# EAGLE design JDM2_NoSocket_Mirrored (EAGLE 7.6.0)
JDM2 without DIL-Socket
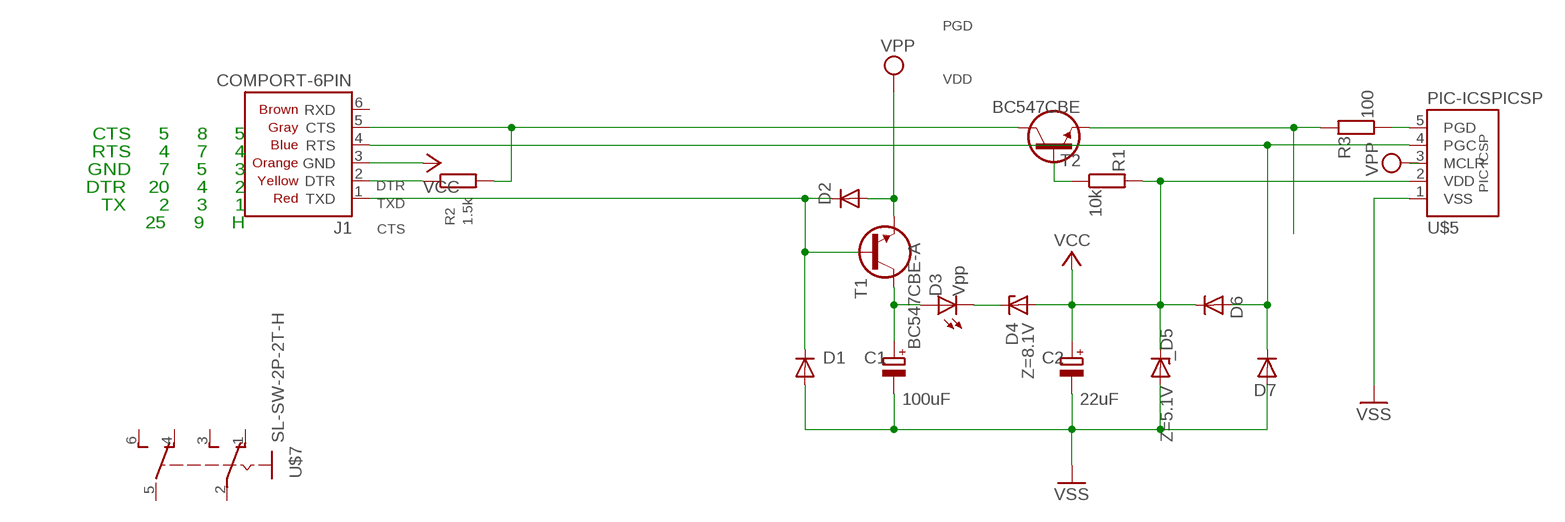
[diagram p0: schematic, sheet 1]

## Parts
_D5  Z=5.1V  Z-DIODEZ2_54  [DO35Z2_54]
C1  100uF  CPOLE5-4  [E5-4]
C2  22uF  CPOLE2,5-4  [E2,5-4]
D1  1N4148  1N414834-2,5-A  [DO34-2,5-A]
D2  1N4148  1N414834-7  [DO34-7]
D3  Vpp  LED3MM  [LED3MM]
D4  Z=8.1V  Z-DIODE34Z5  [DO34Z5]
D6  1N4148  1N414834-5  [DO34-5]
D7  1N4148  1N414834-7  [DO34-7]
J1  COMPORT-6PIN  [RS232-6PIN]
R1  10k  R0202/5  [0202/5]
R2  1.5k  R0202/7  [0202/7]
R3  100  R0202/5  [0202/5]
T1  BC547CBE-A  [TO92-CBE-A]
T2  BC547CBE  [TO92-CBE]
U$5  PIC-ICSPICSP  [PIC-ICSP]
U$7  SL-SW-2P-2T-H  [SLSW-2P2T-H]

## Nets
/MCLR: D2.A T1.E U$5.3(MCLR) ; supply symbol labelled VPP
CLK: D6.A D7.C J1.4(RTS) U$5.4(PGC)
CTS: J1.5(CTS) R2.2 T2.C
DATA: R3.2 T2.E
DTR: J1.2(DTR) R2.1
N$1: R1.1 T2.B
N$5: D3.K(C) D4.C
PGD: R3.1 U$5.5(PGD)
TXD: D1.C D2.C J1.1(TXD) T1.B
VDD: _D5.C C2.+ D4.A D6.C J1.3(GND) R1.2 U$5.2(VDD) ; supply symbol labelled VCC
VPP: C1.+ D3.A T1.C
VSS: _D5.A C1.- C2.- D1.A D7.A U$5.1(VSS)
Unconnected: J1.6(RXD) U$7.1(O) U$7.2(P) U$7.3(S) U$7.4(O1) U$7.5(P1) U$7.6(S1)

## Notes on the sheet
- CTS     5     8     5
- RTS     4     7     4
- GND     7     5     3
- DTR    20     4     2
- TX      2     3     1
- 25     9     H

## Library data of the parts
_D5 D4 = d:Z-DIODE
C1 C2 = c:CPOL: POLARIZED CAPACITOR, European symbol
D1 D2 D6 D7 = d:1N4148
D3 = led:LED: LED OSRAM: - CHIPLED LG R971, LG N971, LY N971, LG Q971, LY Q971, LO R971, LY R971 LH N974, LH R974 LS Q976, LO Q976, LY Q976 LO Q996 - Hyper CHIPLED LW Q18S LB Q993, LB Q99A, LB R99A - SideLED LS A670, LO A670, LY A670, LG A670, LP A670 LB A673, LV A673, LT A673, LW A673 LH A674 LY A675 LS A676, LA A676, LO A676, LY A676, LW A676 LS A679, LY A679, LG A679 - Hyper Micro SIDELED® LS Y876, LA Y876, LO Y876, LY Y876 LT Y87S - SmartLED LW L88C, LW L88S LB L89C, LB L89S, LG L890 LS L89K, LO L89K, LY L89K LS L896, LA L896, LO L896, LY L896 - TOPLED LS T670, LO T670, LY T670, LG T670, LP T670 LSG T670, LSP T670, LSY T670, LOP T670, LYG T670 LG T671, LOG T671, LSG T671 LB T673, LV T673, LT T673, LW T673 LH T674 LS T676, LA T676, LO T676, LY T676, LB T676, LH T676, LSB T676, LW T676 LB T67C, LV T67C, LT T67C, LS T67K, LO T67K, LY T67K, LW E67C LS E67B, LA E67B, LO E67B, LY E67B, LB E67C, LV E67C, LT E67C LW T67C LS T679, LY T679, LG T679 LS T770, LO T770, LY T770, LG T770, LP T770 LB T773, LV T773, LT T773, LW T773 LH T774 LS E675, LA E675, LY E675, LS T675 LS T776, LA T776, LO T776, LY T776, LB T776 LHGB T686 LT T68C, LB T68C - Hyper Mini TOPLED® LB M676 - Mini TOPLED Santana® LG M470 LS M47K, LO M47K, LY M47K Source: http://www.osram.convergy.de LUXEON: - LUMILED® LXK2-PW12-R00, LXK2-PW12-S00, LXK2-PW14-U00, LXK2-PW14-V00 LXK2-PM12-R00, LXK2-PM12-S00, LXK2-PM14-U00 LXK2-PE12-Q00, LXK2-PE12-R00, LXK2-PE12-S00, LXK2-PE14-T00, LXK2-PE14-U00 LXK2-PB12-K00, LXK2-PB12-L00, LXK2-PB12-M00, LXK2-PB14-N00, LXK2-PB14-P00, LXK2-PB14-Q00 LXK2-PR12-L00, LXK2-PR12-M00, LXK2-PR14-Q00, LXK2-PR14-R00 LXK2-PD12-Q00, LXK2-PD12-R00, LXK2-PD12-S00 LXK2-PH12-R00, LXK2-PH12-S00 LXK2-PL12-P00, LXK2-PL12-Q00, LXK2-PL12-R00 Source: www.luxeon.com KINGBRIGHT: KA-3528ASYC Source: www.kingbright.com
J1 = pinconn:COMPORT-6PIN
R1-R3 = r:R: RESISTOR, European symbol
T1 T2 = t:BC547
U$5 = pinconn:PIC-ICSP
U$7 = sw:SL-SW-2P-2T

## Net classes
0 default: width 0.559 mm
1 power: width 0.559 mm

## Board
JDM2 without DIL-Socket
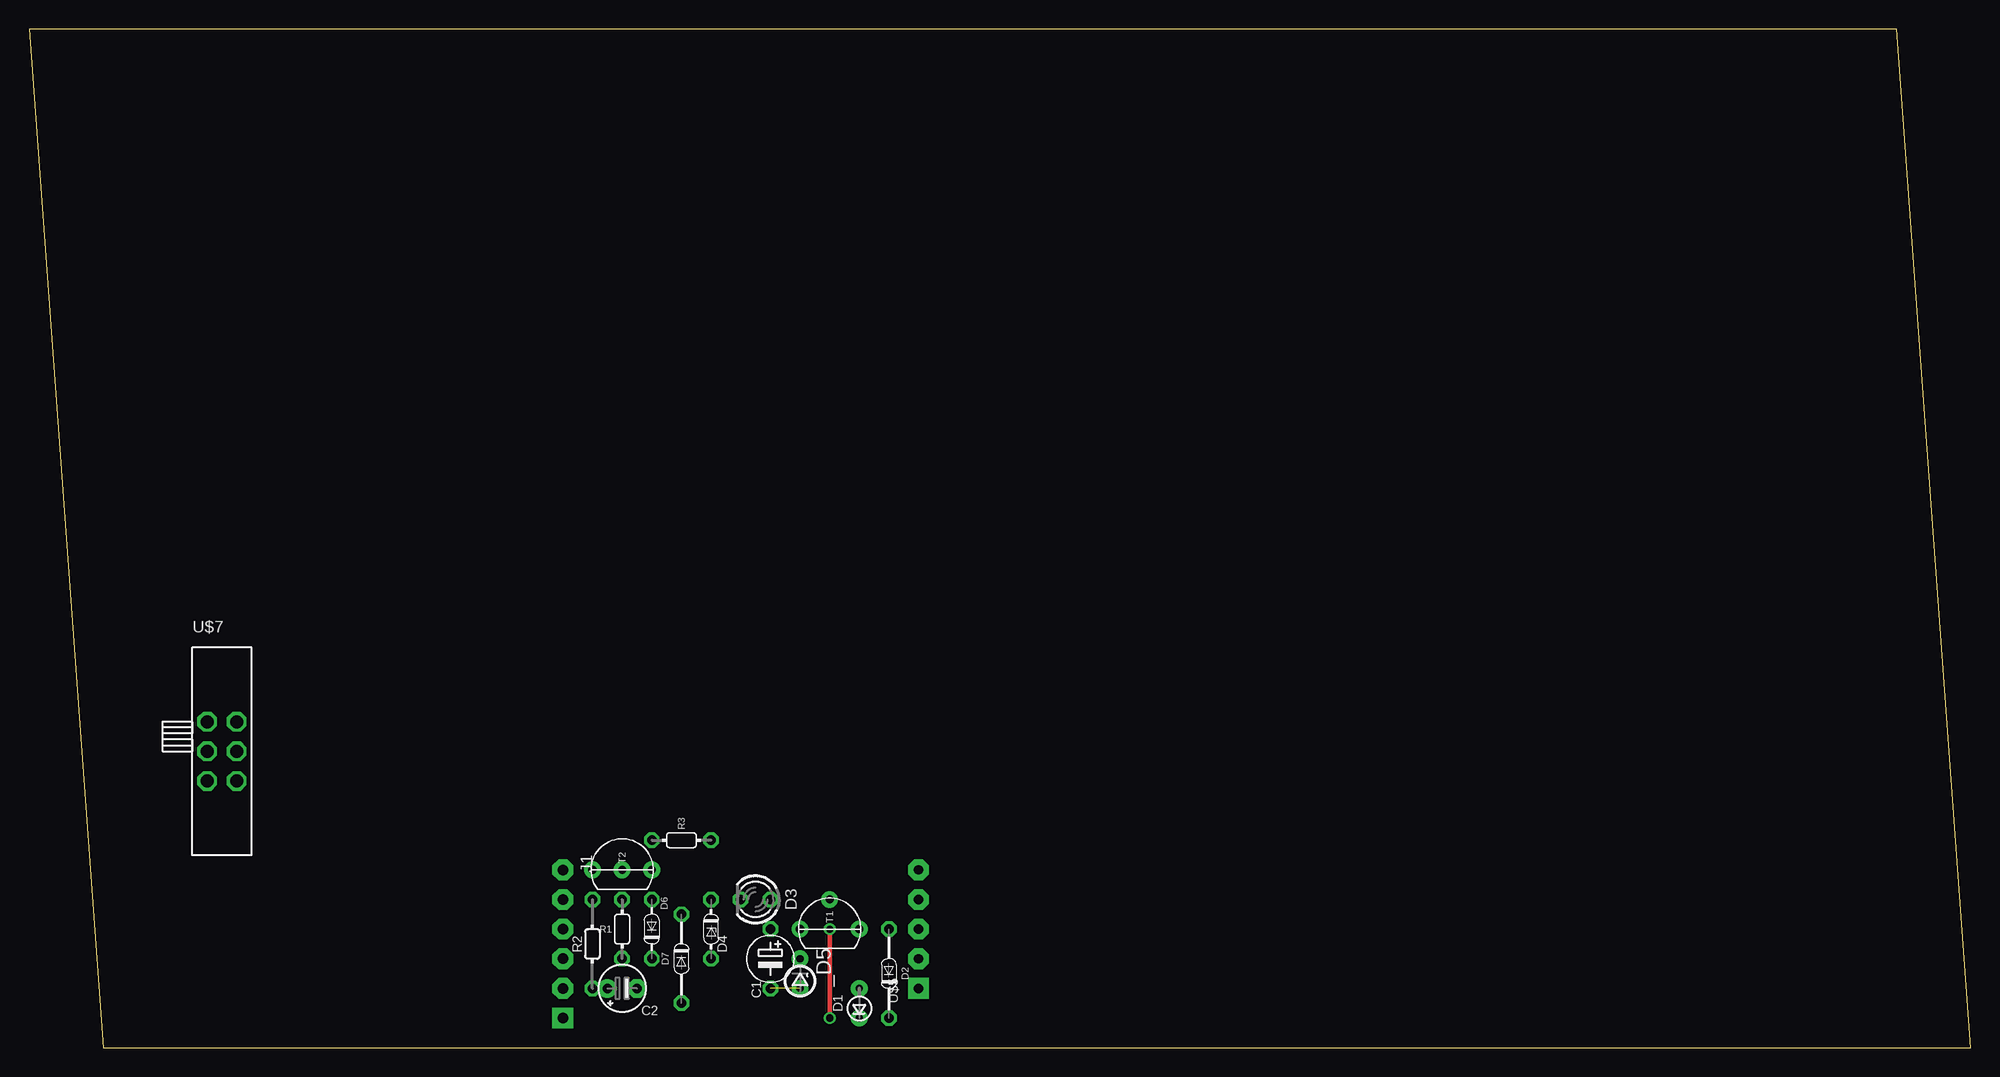
[diagram p1: board, top side]
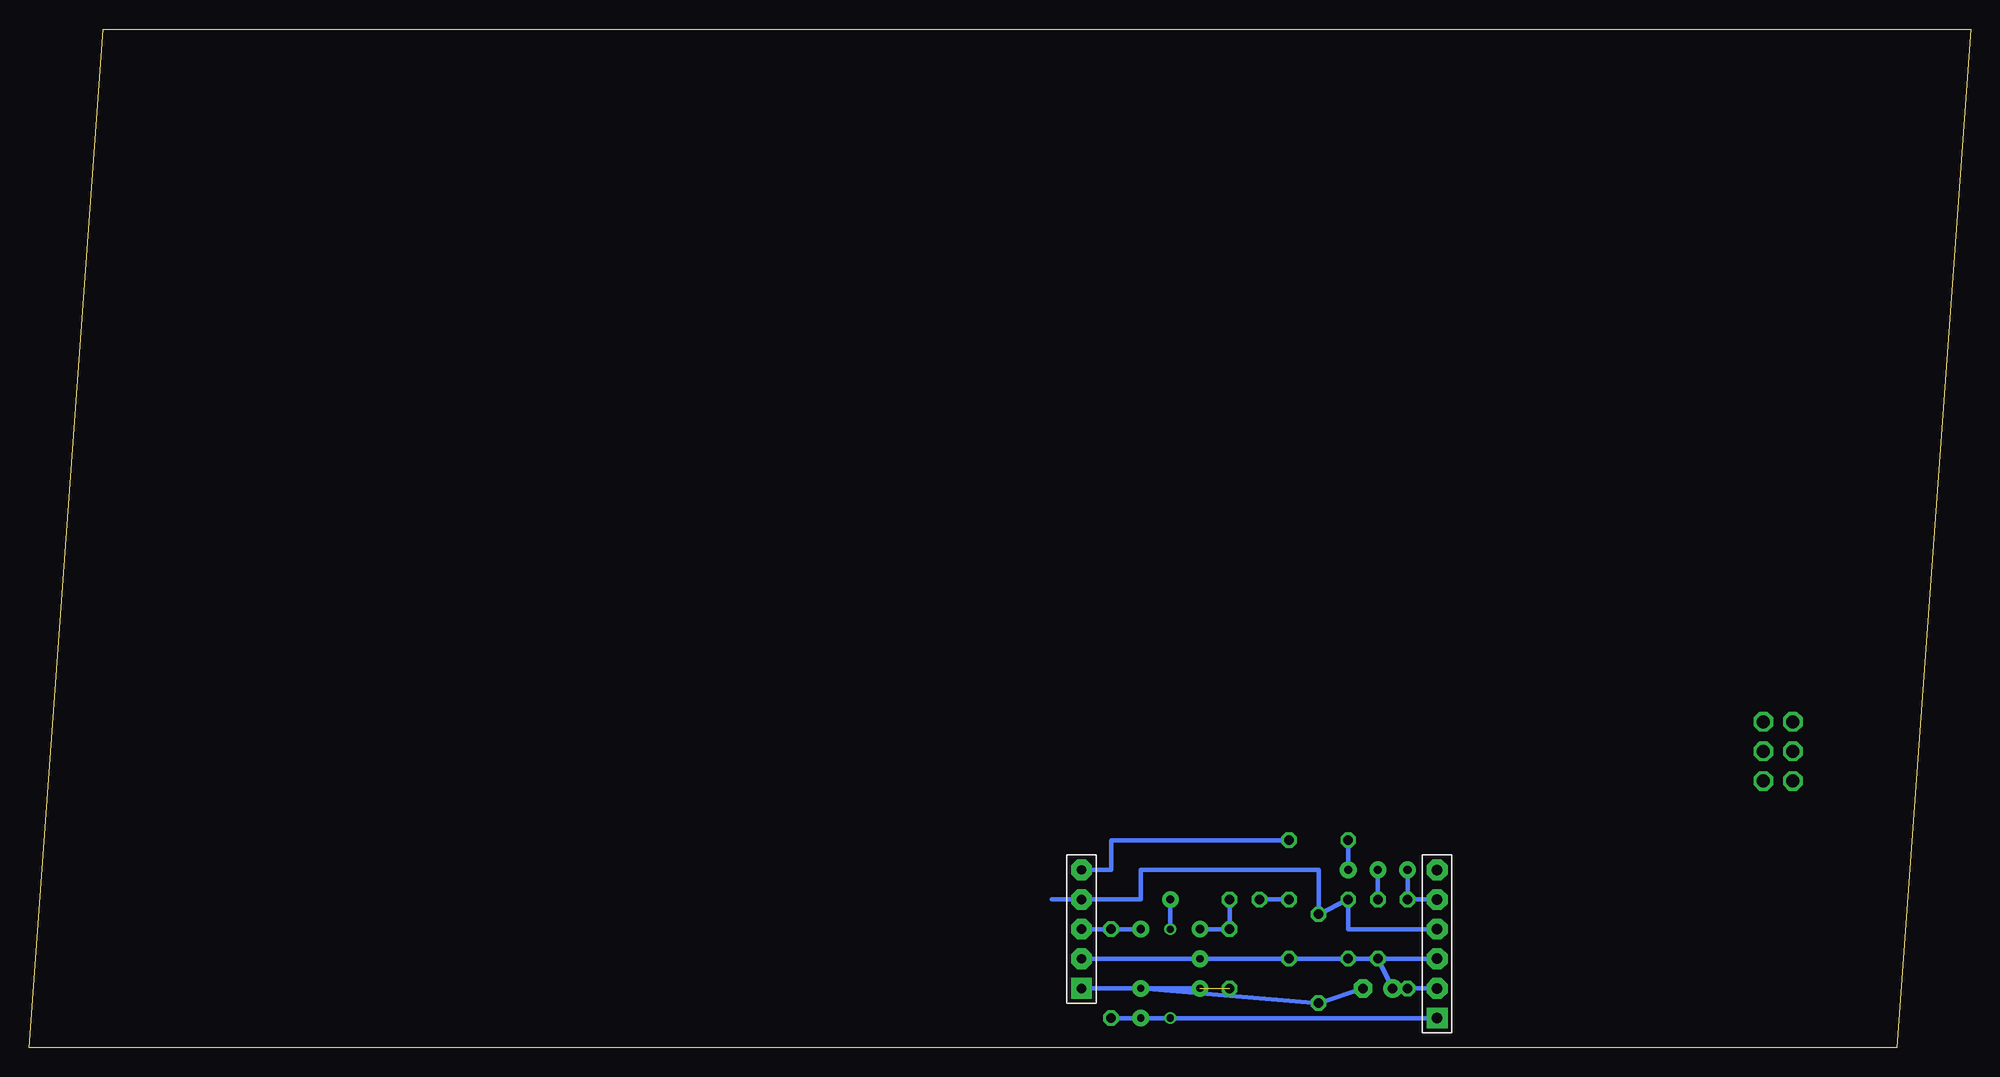
[diagram p2: board, bottom side, seen from below]

Size 166.35 x 87.3 mm. Coordinates in mm from the lower left corner, seen from the top.
Outline: 6.35,0 166.35,0 160,87.3 0,87.3 6.35,0
Copper layers (1*16): Top 0.035mm / dielectric 1.5mm / Bottom 0.035mm
Design rules "default": minimum track width 10mil, minimum drill 24mil, track to track 8mil, track to pad 8mil, pad to pad 8mil, via to via 8mil, smd to smd 8mil, copper to edge 40mil, drill to drill 8mil, minimum pad ring 10mil, minimum via ring 8mil, stop-mask expansion 4mil, vias tented up to drill 0mil, thermal gap 10mil

### Footprints (pad centres in the part's own frame; a part is rotated, then mirrored left to right if it is on the bottom)
DO35Z2_54 = drill 0.6 pad 1.422: A 1.27,0; C -1.27,0
E5-4 = drill 0.813 octagon: + 2.54,0; - -2.54,0
E2,5-4 = drill 0.813 pad 1.6: + 2.54,0 | drill 0.813 pad 1.6 octagon: - 0,0
DO34-2,5-A = drill 0.6 pad 1.422: A 1.27,0; C -1.27,0
DO34-7 = drill 0.813 octagon: A -3.81,0; C 3.81,0
LED3MM = drill 0.813 octagon: A -1.27,0; K 1.27,0
DO34Z5 = drill 0.813 octagon: A -2.54,0; C 2.54,0
DO34-5 = drill 0.813 octagon: A 2.54,0; C -2.54,0
RS232-6PIN = drill 0.9 pad 1.778 square: 1 0,0 | drill 0.9 pad 1.778 octagon: 2 2.54,0; 3 5.08,0; 4 7.62,0; 5 10.16,0; 6 12.7,0
0202/5 = drill 0.813 octagon: 1 0,-2.54; 2 0,2.54
0202/7 = drill 0.813 octagon: 1 0,-3.81; 2 0,3.81
TO92-CBE-A = drill 0.7 pad 1.422: B 2.54,0; C 0,2.54; E 0,-2.54
TO92-CBE = drill 0.7 pad 1.422: B 0,0; C 0,2.54; E 0,-2.54
PIC-ICSP = drill 0.8 pad 1.778 square: 1 -5.08,0 | drill 0.8 pad 1.778 octagon: 2 -2.54,0; 3 0,0; 4 2.54,0; 5 5.08,0
SLSW-2P2T-H = drill 1.118 pad 1.524 octagon: 1 -1.27,2.54; 2 -1.27,0; 3 -1.27,-2.54; 4 1.27,2.54; 5 1.27,0; 6 1.27,-2.54

### Placement (x,y rotation side)
_D5  66.04,6.35 270 top
C1  63.5,7.62 90 top
C2  52.07,5.08 180 top
D1  71.12,3.81 90 top
D2  73.66,6.35 270 top
D3  62.23,12.7 180 top
D4  58.42,10.16 90 top
D6  53.34,10.16 90 top
D7  55.88,7.62 90 top
J1  45.72,2.54 90 top
R1  50.8,10.16 180 top
R2  48.26,8.89 0 top
R3  55.88,17.78 90 top
T1  68.58,10.16 90 top
T2  50.8,15.24 90 top
U$5  76.2,10.16 90 top
U$7  16.51,25.4 0 top

### Tracks (layer width: path | path; a pad name or v marks a point on that pad's centre or on a via)
/MCLR
  Bottom 0.406: U$5.3 D2.A T1.E
CLK
  Bottom 0.406: J1.4 53.34,10.16 D6.A D7.C 55.88,15.24 71.12,15.24 71.12,12.7 U$5.4 78.74,12.7
CTS
  Bottom 0.406: J1.5 R2.2 T2.C
DATA  (via drill 0.6)
  Bottom 0.406: T2.E R3.2
  other vias: 53.34,15.24 53.34,15.24
DTR
  Bottom 0.406: J1.2 R2.1
N$1
  Bottom 0.406: R1.1 T2.B
N$5
  Bottom 0.406: D4.C D3.K
PGD
  Bottom 0.406: R3.1 73.66,17.78 73.66,15.24 U$5.5
TXD  (via drill 0.6)
  Top 0.406: v68.58,2.54 v68.58,10.16
  Bottom 0.406: D2.C v68.58,2.54 D1.C J1.1 | v68.58,10.16 T1.B
  other vias: 68.58,12.7
VDD
  Bottom 0.406: J1.3 R1.2 | U$5.2 _D5.C D4.A D6.C R1.2 | C2.+ R1.2
VPP
  Bottom 0.406: T1.C C1.+ D3.A
VSS  (1 unrouted)
  Bottom 0.406: U$5.1 D1.A | C2.- D7.A D1.A | _D5.A D1.A